# EAGLE design WS2812B breakout (EAGLE 9.6.2)
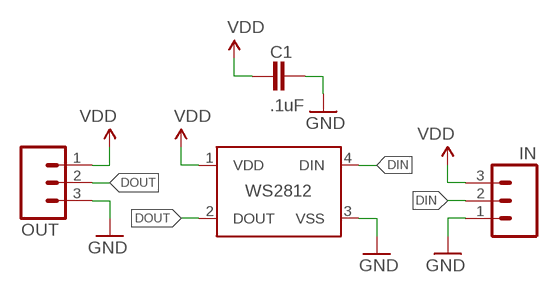
[diagram p0: schematic, sheet 1]

## Parts
C1  .1uF  CAPACITOR_NPOL-0805  [C805]
IN  CONN_03LOCK  [1X03_LOCK]
OUT  CONN_03LOCK  [1X03_LOCK]
WS2812  WS2812B  [WS2812B]

## Nets
DIN: IN.2 WS2812.4(DIN)
DOUT: OUT.2 WS2812.2(DOUT)
GND: C1.2 IN.1 OUT.3 WS2812.3(VSS)
VDD: C1.1 IN.3 OUT.1 WS2812.1(VDD)

## Library data of the parts
C1 = dp_devices:CAPACITOR_NPOL: Non-Polarized capacitor in various packages
IN OUT = SparkFun-Connectors:CONN_03: Multi connection point. Often used as Generic Header-pin footprint for 0.1 inch spaced/style header connections On any of the 0.1 inch spaced packages, you can populate with these: Break Away Headers - Straight <https://www.sparkfun.com/products/116> (PRT-00116) Break Away Male Headers - Right Angle <https://www.sparkfun.com/products/553> (PRT-00553) Female Headers <https://www.sparkfun.com/products/115> (PRT-00115) Break Away Headers - Machine Pin <https://www.sparkfun.com/products/117> (PRT-00117) Break Away Female Headers - Swiss Machine Pin <https://www.sparkfun.com/products/743> (PRT-00743) Stackable Header - 3 Pin (Female, 0.1") <https://www.sparkfun.com/products/13875> (PRT-13875) For SCREWTERMINALS and SPRING TERMINALS visit here: Screw Terimnals on SparkFun.com <https://www.sparkfun.com/search/results?term=Screw+Terminals> (5mm/3.5mm/2.54mm spacing) This device is also useful as a general connection point to wire up your design to another part of your project. Our various solder wires solder well into these plated through hole pads. Hook-Up Wire - Assortment (Stranded, 22 AWG) <https://www.sparkfun.com/products/11375> (PRT-11375) Hook-Up Wire - Assortment (Solid Core, 22 AWG) <https://www.sparkfun.com/products/11367> (PRT-11367) View the entire wire category on our website here <https://www.sparkfun.com/categories/141> Special notes: Molex polarized connector foot print use with SKU : PRT-08232 with associated crimp pins and housings.
WS2812 = SparkFun-LED:WS2812B: WS2812B - Intelligent control LED integrated light source Technical Specifications: Power Supply Voltage (VDD): 3.5 to 5.3 V Input Voltage (VI): -0.5 to VDD+0.5 V Operating Junction Temperature (Topt): -25°C to +80°C Storage Temperature Range (Tstg): -55°C to +150°C

## Board
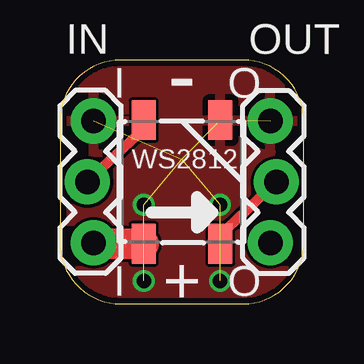
[diagram p1: board, top side]
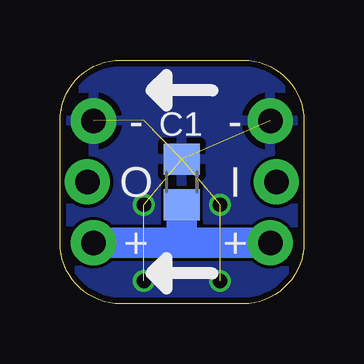
[diagram p2: board, bottom side, seen from below]

Size 10.16 x 10.16 mm. Coordinates in mm from the lower left corner, seen from the top.
Outline: 0,7.62 0,2.54 arc90 2.54,0 7.62,0 arc90 10.16,2.54 10.16,7.62 arc90 7.62,10.16 2.54,10.16 arc90 0,7.62
Copper layers (1*16): Top 0.035mm / dielectric 1.5mm / Bottom 0.035mm
Design rules "dirt_cheap_dirty_boards.v1": minimum track width 5mil, minimum drill 12mil, track to track 5mil, track to pad 5mil, pad to pad 5mil, via to via 5mil, smd to smd 0mil, copper to edge 10mil, drill to drill 10mil, minimum pad ring 10mil, minimum via ring 6mil, stop-mask expansion 2mil, vias tented up to drill 25mil, thermal gap 10mil

### Footprints (pad centres in the part's own frame; a part is rotated, then mirrored left to right if it is on the bottom)
C805 = smd 1.3 x 1.5: 1 -0.95,0; 2 0.95,0
1X03_LOCK = drill 1.016 pad 1.88: 1 0,0.127; 2 2.54,-0.127; 3 5.08,0.127
WS2812B = smd 1.651 x 1: 1 -2.577,1.6; 2 -2.577,-1.6; 3 2.577,-1.6; 4 2.577,1.6

### Placement (x,y rotation side)
C1  5.08,5.08 90 bottom
IN  1.27,7.62 270 top
OUT  8.89,2.54 90 top
WS2812  5.08,5.08 90 top

### Tracks (layer width: path | path; a pad name or v marks a point on that pad's centre or on a via)
DIN
  Top 0.406: IN.2 3.22,7.03 arc45 WS2812.4
DOUT
  Top 0.406: OUT.2 6.94,3.13 arc45 WS2812.2
GND  (via drill 0.6)  (7 unrouted)
  other vias: 3.49,0.95 6.67,0.95 6.67,4.13 3.49,4.13
  pour Top: 0,0 10.16,0 10.16,10.16 0,10.16
  pour Bottom: 0,0 10.16,0 10.16,10.16 0,10.16
VDD
  Top 1.27: IN.3 arc45 1.36,2.5 WS2812.1
  Bottom 1.27: OUT.1 5.08,2.54 | 5.08,2.54 IN.3 | C1.1 5.08,2.54

### Text on the board
tNames: I | O | - | I | + | O
bNames: - / I / + | - / O / +